# Altium schematic sheet C-05 LPDDR4_x.SchDoc
size 513 x 386 mm; Address1: 350W 9th Ave; Address2: Suite 206; Address3: Escondido CA 92025; Address4: United States; Revision: -; ENG_APP_DATE: --/--/--; DSN_APP_DATE: --/--/--; CHK_APP_DATE: --/--/--
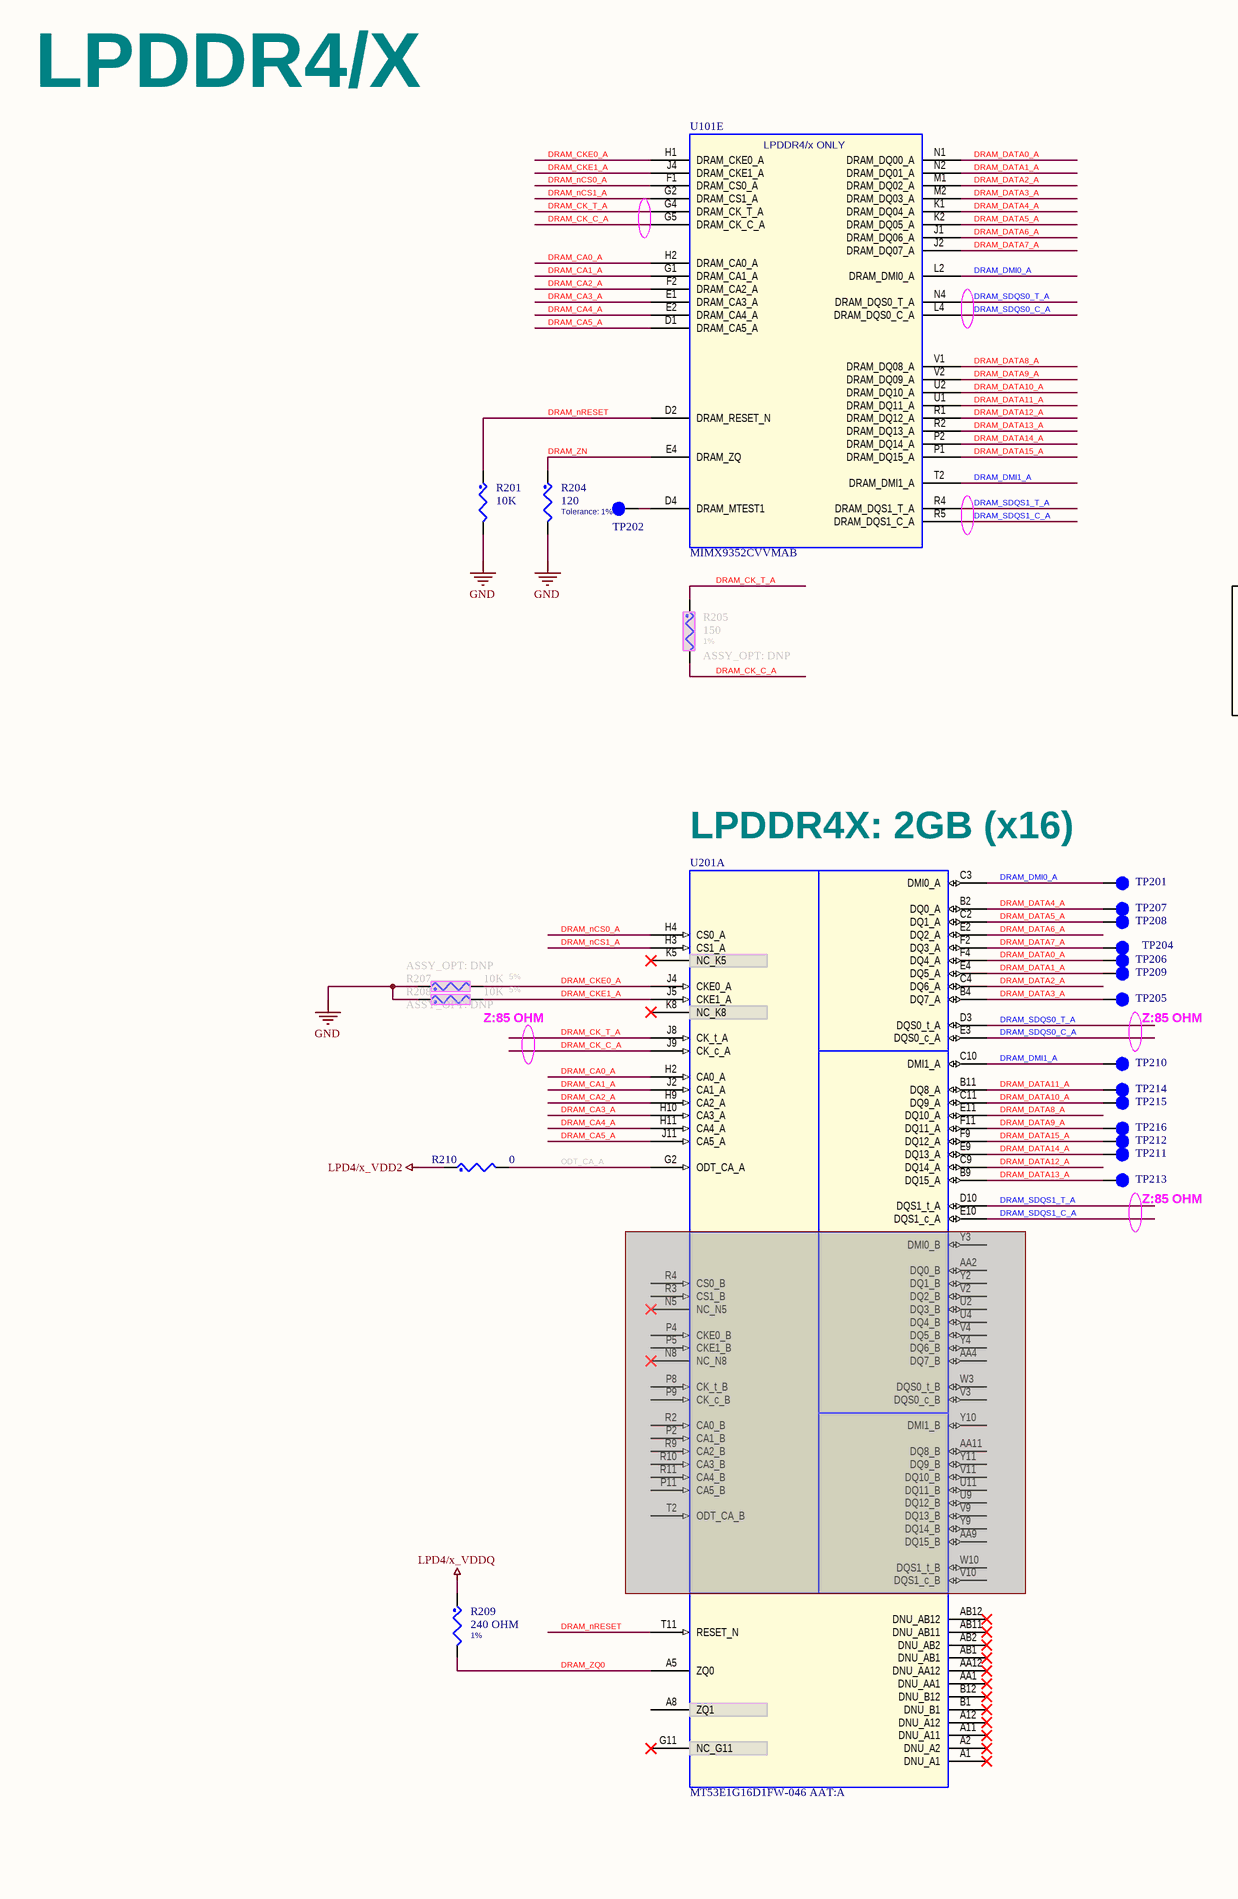
[diagram p0: C-05 LPDDR4_x.SchDoc, left]
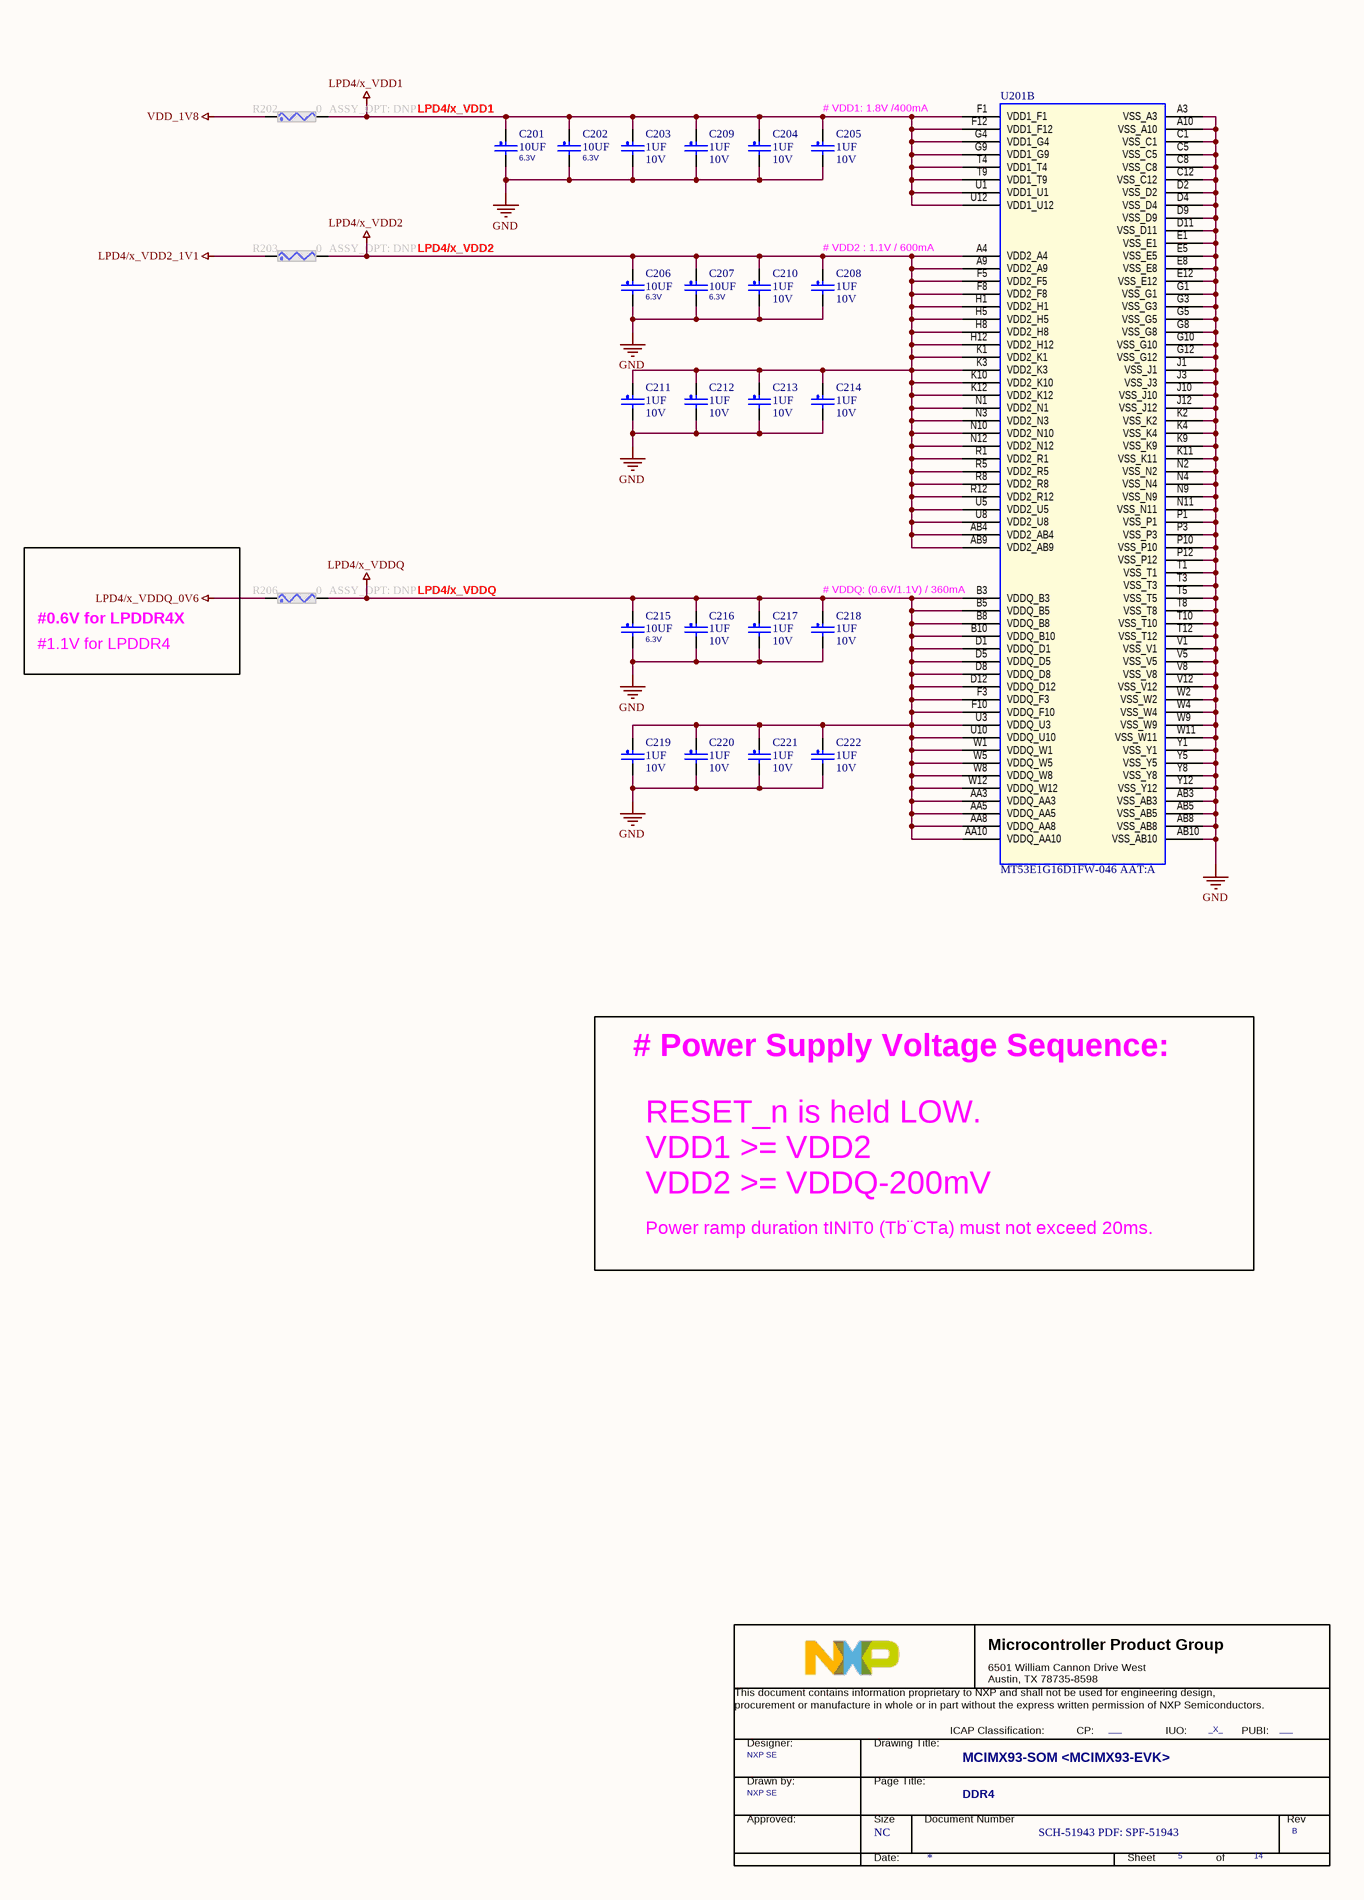
[diagram p1: C-05 LPDDR4_x.SchDoc, right]

## Parts
*  Doc: SCH-51943 PDF: SPF-51943  RevCode: B  Title: MCIMX93-SOM <MCIMX93-EVK>  Page Size: NC  Page Number: 5  Page Count: 14  PageTitle: DDR4  Designer: NXP SE  PUBI: ___  FIUO: _X_  (hidden comment: TitleBlock_MCPG)  (graphical)
C201  10UF  VOLTAGE: 6.3V  [0402_CC]
C202  10UF  VOLTAGE: 6.3V  [0402_CC]
C203  1UF  VOLTAGE: 10V  [0201_CC]
C204  1UF  VOLTAGE: 10V  [0201_CC]
C205  1UF  VOLTAGE: 10V  [0201_CC]
C206  10UF  VOLTAGE: 6.3V  [0402_CC]
C207  10UF  VOLTAGE: 6.3V  [0402_CC]
C208  1UF  VOLTAGE: 10V  [0201_CC]
C209  1UF  VOLTAGE: 10V  [0201_CC]
C210  1UF  VOLTAGE: 10V  [0201_CC]
C211  1UF  VOLTAGE: 10V  [0201_CC]
C212  1UF  VOLTAGE: 10V  [0201_CC]
C213  1UF  VOLTAGE: 10V  [0201_CC]
C214  1UF  VOLTAGE: 10V  [0201_CC]
C215  10UF  VOLTAGE: 6.3V  [0402_CC]
C216  1UF  VOLTAGE: 10V  [0201_CC]
C217  1UF  VOLTAGE: 10V  [0201_CC]
C218  1UF  VOLTAGE: 10V  [0201_CC]
C219  1UF  VOLTAGE: 10V  [0201_CC]
C220  1UF  VOLTAGE: 10V  [0201_CC]
C221  1UF  VOLTAGE: 10V  [0201_CC]
C222  1UF  VOLTAGE: 10V  [0201_CC]
R201  10K  [0402_CC]
R202  0  ASSY_OPT: DNP  [0603_CC]
R203  0  ASSY_OPT: DNP  [0603_CC]
R204  120  Tolerance: 1%  [0402_CC]
R205  150  ASSY_OPT: DNP  Tolerance: 1%  [0402_CC]
R206  0  ASSY_OPT: DNP  [0603_CC]
R207  10K  ASSY_OPT: DNP  Tolerance: 5%  [0402_CC]
R208  10K  ASSY_OPT: DNP  Tolerance: 5%  [0402_CC]
R209  240 OHM  Tolerance: 1%  [0201_CC]
R210  0  [0402_CC]
TP201  TPAD_015  [TPAD_015]  (value not drawn)  (no BOM)
TP202  tpad_020  [tpad_020]  (value not drawn)  (no BOM)
TP204  TPAD_015  [TPAD_015]  (value not drawn)  (no BOM)
TP205  TPAD_015  [TPAD_015]  (value not drawn)  (no BOM)
TP206  TPAD_015  [TPAD_015]  (value not drawn)  (no BOM)
TP207  TPAD_015  [TPAD_015]  (value not drawn)  (no BOM)
TP208  TPAD_015  [TPAD_015]  (value not drawn)  (no BOM)
TP209  TPAD_015  [TPAD_015]  (value not drawn)  (no BOM)
TP210  TPAD_015  [TPAD_015]  (value not drawn)  (no BOM)
TP211  TPAD_015  [TPAD_015]  (value not drawn)  (no BOM)
TP212  TPAD_015  [TPAD_015]  (value not drawn)  (no BOM)
TP213  TPAD_015  [TPAD_015]  (value not drawn)  (no BOM)
TP214  TPAD_015  [TPAD_015]  (value not drawn)  (no BOM)
TP215  TPAD_015  [TPAD_015]  (value not drawn)  (no BOM)
TP216  TPAD_015  [TPAD_015]  (value not drawn)  (no BOM)
U101  MIMX9352CVVMAB  [SKT_BGA306_0P5_SQ16P23_ELAST]  (part E of 6)
U201  MT53E1G16D1FW-046 AAT:A  [bga200_0p65x0p8_10x14p5]  (parts A,B of 2)

## Nets
GND: C201.2 C202.2 C203.2 C204.2 C205.2 C206.2 C207.2 C208.2 C209.2 C210.2 C211.2 C212.2 C213.2 C214.2 C215.2 C216.2 C217.2 C218.2 C219.2 C220.2 C221.2 C222.2 R201.2 R204.2 R207.1 R208.1 U201.A3(VSS_A3) U201.A10(VSS_A10) U201.AB3(VSS_AB3) U201.AB5(VSS_AB5) U201.AB8(VSS_AB8) U201.AB10(VSS_AB10) U201.C1(VSS_C1) U201.C5(VSS_C5) U201.C8(VSS_C8) U201.C12(VSS_C12) U201.D2(VSS_D2) U201.D4(VSS_D4) U201.D9(VSS_D9) U201.D11(VSS_D11) U201.E1(VSS_E1) U201.E5(VSS_E5) U201.E8(VSS_E8) U201.E12(VSS_E12) U201.G1(VSS_G1) U201.G3(VSS_G3) U201.G5(VSS_G5) U201.G8(VSS_G8) U201.G10(VSS_G10) U201.G12(VSS_G12) U201.J1(VSS_J1) U201.J3(VSS_J3) U201.J10(VSS_J10) U201.J12(VSS_J12) U201.K2(VSS_K2) U201.K4(VSS_K4) U201.K9(VSS_K9) U201.K11(VSS_K11) U201.N2(VSS_N2) U201.N4(VSS_N4) U201.N9(VSS_N9) U201.N11(VSS_N11) U201.P1(VSS_P1) U201.P3(VSS_P3) U201.P10(VSS_P10) U201.P12(VSS_P12) U201.T1(VSS_T1) U201.T3(VSS_T3) U201.T5(VSS_T5) U201.T8(VSS_T8) U201.T10(VSS_T10) U201.T12(VSS_T12) U201.V1(VSS_V1) U201.V5(VSS_V5) U201.V8(VSS_V8) U201.V12(VSS_V12) U201.W2(VSS_W2) U201.W4(VSS_W4) U201.W9(VSS_W9) U201.W11(VSS_W11) U201.Y1(VSS_Y1) U201.Y5(VSS_Y5) U201.Y8(VSS_Y8) U201.Y12(VSS_Y12)
LPD4/x_VDD1: C201.1 C202.1 C203.1 C204.1 C205.1 C209.1 R202.2 U201.F1(VDD1_F1) U201.F12(VDD1_F12) U201.G4(VDD1_G4) U201.G9(VDD1_G9) U201.T4(VDD1_T4) U201.T9(VDD1_T9) U201.U1(VDD1_U1) U201.U12(VDD1_U12)
LPD4/x_VDD2: C206.1 C207.1 C208.1 C210.1 C211.1 C212.1 C213.1 C214.1 R203.2 R210.1 U201.A4(VDD2_A4) U201.A9(VDD2_A9) U201.AB4(VDD2_AB4) U201.AB9(VDD2_AB9) U201.F5(VDD2_F5) U201.F8(VDD2_F8) U201.H1(VDD2_H1) U201.H5(VDD2_H5) U201.H8(VDD2_H8) U201.H12(VDD2_H12) U201.K1(VDD2_K1) U201.K3(VDD2_K3) U201.K10(VDD2_K10) U201.K12(VDD2_K12) U201.N1(VDD2_N1) U201.N3(VDD2_N3) U201.N10(VDD2_N10) U201.N12(VDD2_N12) U201.R1(VDD2_R1) U201.R5(VDD2_R5) U201.R8(VDD2_R8) U201.R12(VDD2_R12) U201.U5(VDD2_U5) U201.U8(VDD2_U8)
LPD4/x_VDD2_1V1: R203.1
LPD4/x_VDDQ: C215.1 C216.1 C217.1 C218.1 C219.1 C220.1 C221.1 C222.1 R206.2 R209.1 U201.AA3(VDDQ_AA3) U201.AA5(VDDQ_AA5) U201.AA8(VDDQ_AA8) U201.AA10(VDDQ_AA10) U201.B3(VDDQ_B3) U201.B5(VDDQ_B5) U201.B8(VDDQ_B8) U201.B10(VDDQ_B10) U201.D1(VDDQ_D1) U201.D5(VDDQ_D5) U201.D8(VDDQ_D8) U201.D12(VDDQ_D12) U201.F3(VDDQ_F3) U201.F10(VDDQ_F10) U201.U3(VDDQ_U3) U201.U10(VDDQ_U10) U201.W1(VDDQ_W1) U201.W5(VDDQ_W5) U201.W8(VDDQ_W8) U201.W12(VDDQ_W12)
LPD4/x_VDDQ_0V6: R206.1
VDD_1V8: R202.1
DRAM_CA0_A: U101.H2(DRAM_CA0_A) U201.H2(CA0_A)
DRAM_CA1_A: U101.G1(DRAM_CA1_A) U201.J2(CA1_A)
DRAM_CA2_A: U101.F2(DRAM_CA2_A) U201.H9(CA2_A)
DRAM_CA3_A: U101.E1(DRAM_CA3_A) U201.H10(CA3_A)
DRAM_CA4_A: U101.E2(DRAM_CA4_A) U201.H11(CA4_A)
DRAM_CA5_A: U101.D1(DRAM_CA5_A) U201.J11(CA5_A)
DRAM_CK_C_A: R205.2 U101.G5(DRAM_CK_C_A) U201.J9(CK_c_A)
DRAM_CK_T_A: R205.1 U101.G4(DRAM_CK_T_A) U201.J8(CK_t_A)
DRAM_CKE0_A: R207.2 U101.H1(DRAM_CKE0_A) U201.J4(CKE0_A)
DRAM_CKE1_A: R208.2 U101.J4(DRAM_CKE1_A) U201.J5(CKE1_A)
DRAM_DATA0_A: TP206.1(Pin1) U101.N1(DRAM_DQ00_A) U201.F4(DQ4_A)
DRAM_DATA1_A: TP209.1(Pin1) U101.N2(DRAM_DQ01_A) U201.E4(DQ5_A)
DRAM_DATA2_A: U101.M1(DRAM_DQ02_A) U201.C4(DQ6_A)
DRAM_DATA3_A: TP205.1(Pin1) U101.M2(DRAM_DQ03_A) U201.B4(DQ7_A)
DRAM_DATA4_A: TP207.1(Pin1) U101.K1(DRAM_DQ04_A) U201.B2(DQ0_A)
DRAM_DATA5_A: TP208.1(Pin1) U101.K2(DRAM_DQ05_A) U201.C2(DQ1_A)
DRAM_DATA6_A: U101.J1(DRAM_DQ06_A) U201.E2(DQ2_A)
DRAM_DATA7_A: TP204.1(Pin1) U101.J2(DRAM_DQ07_A) U201.F2(DQ3_A)
DRAM_DATA8_A: U101.V1(DRAM_DQ08_A) U201.E11(DQ10_A)
DRAM_DATA9_A: TP216.1(Pin1) U101.V2(DRAM_DQ09_A) U201.F11(DQ11_A)
DRAM_DATA10_A: TP215.1(Pin1) U101.U2(DRAM_DQ10_A) U201.C11(DQ9_A)
DRAM_DATA11_A: TP214.1(Pin1) U101.U1(DRAM_DQ11_A) U201.B11(DQ8_A)
DRAM_DATA12_A: U101.R1(DRAM_DQ12_A) U201.C9(DQ14_A)
DRAM_DATA13_A: TP213.1(Pin1) U101.R2(DRAM_DQ13_A) U201.B9(DQ15_A)
DRAM_DATA14_A: TP211.1(Pin1) U101.P2(DRAM_DQ14_A) U201.E9(DQ13_A)
DRAM_DATA15_A: TP212.1(Pin1) U101.P1(DRAM_DQ15_A) U201.F9(DQ12_A)
DRAM_DMI0_A: TP201.1(Pin1) U101.L2(DRAM_DMI0_A) U201.C3(DMI0_A)
DRAM_DMI1_A: TP210.1(Pin1) U101.T2(DRAM_DMI1_A) U201.C10(DMI1_A)
DRAM_nCS0_A: U101.F1(DRAM_CS0_A) U201.H4(CS0_A)
DRAM_nCS1_A: U101.G2(DRAM_CS1_A) U201.H3(CS1_A)
DRAM_nRESET: R201.1 U101.D2(DRAM_RESET_N) U201.T11(RESET_N)
DRAM_SDQS0_C_A: U101.L4(DRAM_DQS0_C_A) U201.E3(DQS0_c_A)
DRAM_SDQS0_T_A: U101.N4(DRAM_DQS0_T_A) U201.D3(DQS0_t_A)
DRAM_SDQS1_C_A: U101.R5(DRAM_DQS1_C_A) U201.E10(DQS1_c_A)
DRAM_SDQS1_T_A: U101.R4(DRAM_DQS1_T_A) U201.D10(DQS1_t_A)
DRAM_ZN: R204.1 U101.E4(DRAM_ZQ)
DRAM_ZQ0: R209.2 U201.A5(ZQ0)
ODT_CA_A: R210.2 U201.G2(ODT_CA_A)
NetTP202_1: TP202.1(Pin1) U101.D4(DRAM_MTEST1)

Not connected (* = marked no-connect by the designer): U201 A1(DNU_A1)* A2(DNU_A2)* A8(ZQ1) A11(DNU_A11)* A12(DNU_A12)* AA1(DNU_AA1)* AA2(DQ0_B) AA4(DQ7_B) AA9(DQ15_B) AA11(DQ8_B) AA12(DNU_AA12)* AB1(DNU_AB1)* AB2(DNU_AB2)* AB11(DNU_AB11)* AB12(DNU_AB12)* B1(DNU_B1)* B12(DNU_B12)* G11(NC_G11)* K5(NC_K5)* K8(NC_K8)* N5(NC_N5)* N8(NC_N8)* P2(CA1_B) P4(CKE0_B) P5(CKE1_B) P8(CK_t_B) P9(CK_c_B) P11(CA5_B) R2(CA0_B) R3(CS1_B) R4(CS0_B) R9(CA2_B) R10(CA3_B) R11(CA4_B) T2(ODT_CA_B) U2(DQ3_B) U4(DQ4_B) U9(DQ12_B) U11(DQ11_B) V2(DQ2_B) V3(DQS0_c_B) V4(DQ5_B) V9(DQ13_B) V10(DQS1_c_B) V11(DQ10_B) W3(DQS0_t_B) W10(DQS1_t_B) Y2(DQ1_B) Y3(DMI0_B) Y4(DQ6_B) Y9(DQ14_B) Y10(DMI1_B) Y11(DQ9_B)

## Notes on the sheet
- LPDDR4/X
- (near C205) # VDD1: 1.8V /400mA
- (near C208) # VDD2 : 1.1V / 600mA
- #0.6V for LPDDR4X
- # VDDQ: (0.6V/1.1V) / 360mA
- #1.1V for LPDDR4
- (near U201) LPDDR4X: 2GB (x16)
- Z:85 OHM
- # Power Supply Voltage Sequence:
- RESET_n is held LOW.
  VDD1 >= VDD2
  VDD2 >= VDDQ-200mV
- Power ramp duration tINIT0 (Tb¨CTa) must not exceed 20ms.
- 8
- 7
- 6
- 5
- 4
- 3
- 2
- 1
- REVISION
- DESCRIPTION
- DATE
- APPROVED
- F
- E
- D
- C
- B
- PROJECT:
- REV.
- ENG:
- APPROVALS
- PROJECT
- JordanDSP LLC <https://www.jordandsp.com>
- Envision Excellence
- SHT.
- A
- DSN:
- CHK:
- REFERENCE ITEMS
- PRJ VCS REVISION:
- TITLE
- DOC VCS REVISION:
- MODIFIED DATE:
- BOM:
- FAB DWG:
- FIRMWARE:
- ASSY DWG:
- SCALE:
- SIZE
- CAGE CODE
- FILE NAME
- DWG NO.
- PAGE
- PRODUCT REV
- OF
- (in symbol MIMX9352DVNxLAA, part E) LPDDR4/x ONLY
- (in symbol TitleBlock_MCPG) Microcontroller Product Group; 6501 William Cannon Drive West / Austin, TX 78735-8598; This document contains information proprietary to NXP and shall not be used for engineering design,; procurement or manufacture in whole or in part without the express written permission of NXP Semiconductors.; ICAP Classification:; CP:; IUO:; PUBI:; Designer:; Drawing Title:; Drawn by:; Page Title:; Approved:; Size; Document Number; Rev; Date:; Sheet; of

## Library data of the parts
* = TitleBlock_MCPG: OrgName: NXP Semiconductor; OrgAddr1: NO. 192 Liangjing Rd. Pudong New Area, ShangHai; Page Create Date: March  8, 1995; DrawnBy: NXP SE; FCP: ___; Page Modify Date: *
C201 C202 C206 C207 C215 = CAP_NP: CAP CER 10UF 6.3V 20% X5R 0402; CLASS: DISCRETE; AGILE_PN: 150-79163; MFG_NAME01: SAMSUNG ELECTRO MECHANICS; MFG_PN01: CL05A106MQ5NUNC; CAD_APPROVED: Yes; FPLIST: CC0402_25,CC0402_HD,0402_CC; PCB Footprint: 0402_CC; Tolerance: 20%; ROHS: Yes; HEIGHT: 0.65 MM
C203 C205 C211-C213 C216 C218 C220 C222 = CAP_NP: CAP CER 1.0uF 10V 10% X5R 0201; CLASS: DISCRETE; FPLIST: CC0201,CC0201_HD,0201_CC,cc_0201_cir; CAD_APPROVED: Yes; MFG_PN01: CL03A105KP3NSNC; MFG_NAME01: SAMSUNG ELECTRO MECHANICS; AGILE_PN: 150-81088; Temp Range: -55¡ãC to 85¡ãC; Package Type: SMD/SMT; Package Size: 0201 (0603 Metric); HEIGHT: 0.35MM; ROHS: Yes; Tolerance: 10%; PCB Footprint: 0201_CC
C204 C208-C210 C214 C217 C219 C221 = CAP_NP: CAP CER 1.0uF 10V 10% X5R 0201; CLASS: DISCRETE; AGILE_PN: 150-81088; MFG_NAME01: SAMSUNG ELECTRO MECHANICS; MFG_PN01: CL03A105KP3NSNC; CAD_APPROVED: Yes; FPLIST: CC0201,CC0201_HD,0201_CC,cc_0201_cir; Temp Range: -55¡ãC to 85¡ãC; Package Type: SMD/SMT; Package Size: 0201 (0603 Metric); Tolerance: 10%; ROHS: Yes; HEIGHT: 0.35MM; PCB Footprint: 0201_CC
R201 R207 R208 = RES: RES MF 10K 1/16W 5% 0402; CLASS: DISCRETE; FPLIST: RC0402_25,RC0402_HD,0402_CC; CAD_APPROVED: Yes; MFG_PN01: CRCW040210K0JNED; MFG_NAME01: VISHAY INTERTECHNOLOGY; AGILE_PN: 470-75557; PCB Footprint: 0402_CC; HEIGHT: 0.4 MM; ROHS: Yes
  R201: Tolerance: 5%
R202 R206 = RES: RES MF ZERO OHM 1/10W -- 0603; CLASS: DISCRETE; Temp Range: ¨C55 ¡ãC to +155 ¡ãC; FPLIST: RC0603_OV,RC0603,R603-X2,0603_CC,IND_0603HP_NSP,CC0603_OV_NSP; CAD_APPROVED: Yes; MFG_PN01: WR06X000PTL; MFG_NAME01: WALSIN TECHNOLOGY CORP.; AGILE_PN: 470-80866; PCB Footprint: 0603_CC; HEIGHT: 0.6MM; ROHS: Yes
R203 = RES: RES MF ZERO OHM 1/10W -- 0603; CLASS: DISCRETE; AGILE_PN: 470-80866; MFG_NAME01: WALSIN TECHNOLOGY CORP.; MFG_PN01: WR06X000PTL; CAD_APPROVED: Yes; FPLIST: RC0603_OV,RC0603,R603-X2,0603_CC,IND_0603HP_NSP,CC0603_OV_NSP; Temp Range: ¨C55 ¡ãC to +155 ¡ãC; PCB Footprint: 0603_CC; ROHS: Yes; HEIGHT: 0.6MM
R204 = RES: RES MF 120 OHM 1/10W 1% AEC-Q200 0402; CLASS: DISCRETE; MFG_PN01: ERJ-2RKF1200X; MFG_NAME01: Panasonic; Temp Range: -55¡ãC ~ 155¡ãC; CAD_APPROVED: Yes; FPLIST: RC0402_25,RC0402_HD,0402_CC; AGILE_PN: 470-82646; PCB Footprint: 0402_CC; VOLTAGE: 1/10W; ROHS: Yes; HEIGHT: 0.4MM
R205 = RES: RES MF 150 OHM 1/16W 1% 0402; CLASS: DISCRETE; FPLIST: RC0402_25,RC0402_HD,0402_CC; CAD_APPROVED: Yes; MFG_PN01: NRCL04F1500TRF; MFG_NAME01: NIC COMPONENTS CORP; AGILE_PN: 470-75353; PCB Footprint: 0402_CC; HEIGHT: 0.4MM; ROHS: Yes
R209 = RES: RES MF 240 OHM 1/20W 1% 0201; CLASS: DISCRETE; Temp Range: -55¡ãC ~ 125¡ãC; VOLTAGE: 25V; FPLIST: CC0201,CC0201_HD,0201_CC; CAD_APPROVED: Yes; MFG_PN01: RC0201FR-07240RL; MFG_NAME01: YAGEO AMERICA; AGILE_PN: 470-81317; PCB Footprint: 0201_CC; HEIGHT: 0.26MM; Temp_Range: -55¡ãC ~ 125¡ãC; ROHS: Yes
R210 = RES: RES MF ZERO OHM 1/16W 5% 0402; CLASS: DISCRETE; AGILE_PN: 470-75394; MFG_NAME01: YAGEO AMERICA; MFG_PN01: RC0402JR-070RL; CAD_APPROVED: Yes; FPLIST: RC0402_25,RC0402_HD,RC0402_X2,0402_CC; PCB Footprint: 0402_CC; VOLTAGE: 1/16W; Tolerance: 5%; ROHS: Yes; HEIGHT: 0.45 MM
TP201 TP204-TP207 TP210-TP215 = TESTLOOP: TEST POINT PAD 15MIL DIA SMT, NO PART TO ORDER; CLASS: IO; CAD_APPROVED: Yes; MFG_PN01: NOTACOMPONENT; AGILE_PN: 211-76645; PCB Footprint: TPAD_015; HEIGHT: 0.1MM; ROHS: Yes; MFG_NAME01: NOTACOMPONENT
TP202 = TESTLOOP: TEST POINT PAD 0.5MM DIA SMT, NO PART TO ORDER; ASSY_OPT: DNP; CLASS: IO; AGILE_PN: 211-77484; CAD_APPROVED: Yes; PCB Footprint: tpad_020; ROHS: Yes; HEIGHT: 0.1MM
TP208 TP209 TP216 = TESTLOOP: TEST POINT PAD 15MIL DIA SMT, NO PART TO ORDER; CLASS: IO; AGILE_PN: 211-76645; MFG_NAME01: NOTACOMPONENT; CAD_APPROVED: Yes; PCB Footprint: TPAD_015; MFG_PN01: NOTACOMPONENT; ROHS: Yes; HEIGHT: 0.1MM
U101 = MIMX9352DVNxLAA: SUBASSEMBLY SKT 306 BGA ELASTOMER SMT 0.5MM 395H AU + IC CPU 1.7GHz -- FCBGA306; MFG_PN01: 211-81728,330-77207; CAD_APPROVED: Yes; FPLIST: skt_bga306_0p5_sq16p23_elast,skt_bga306_0p5_sq16p23_elast_nsp; AGILE_PN: 750-78710; PCB Footprint: skt_bga306_0p5_sq16p23_elast_nsp; CLASS: IC; MFG_NAME01: SUBASSEMBLY; ROHS: Yes; HEIGHT: 10.03MM; Manufacturer Part Number: MIMX9352CVVMAB
U201 = MT53B768M32D4NQ_200P: IC MEM LPDDR4/LPDDR4X SDRAM 1GX16 1.1V AEC-Q100 TFBGA200; SPLIT_INST: TRUE; SWAP_INFO: (S1+S2); AGILE_PN: 334-77894; MFG_NAME01: MICRON; Temp_Range: -40C to +105C¡ãC; CAD_APPROVED: Yes; CLASS: IC; PCB Footprint: bga200_0p65x0p8_10x14p5; MFG_PN01: MT53E1G16D1FW-046 AAT:A; ROHS: Yes; PRE_APN: 334-77894; HEIGHT: 0.95MM; VOLTAGE: 1.1V; Temp Range: -40C to +105C¡ãC